# Altium schematic sheet Auxiliary Motors.SchDoc
size A4; Organization: Altium Limited; Address1: L3, 12a Rodborough Rd; Address2: Frenchs Forest; Address3: NSW; Address4: Australia 2086
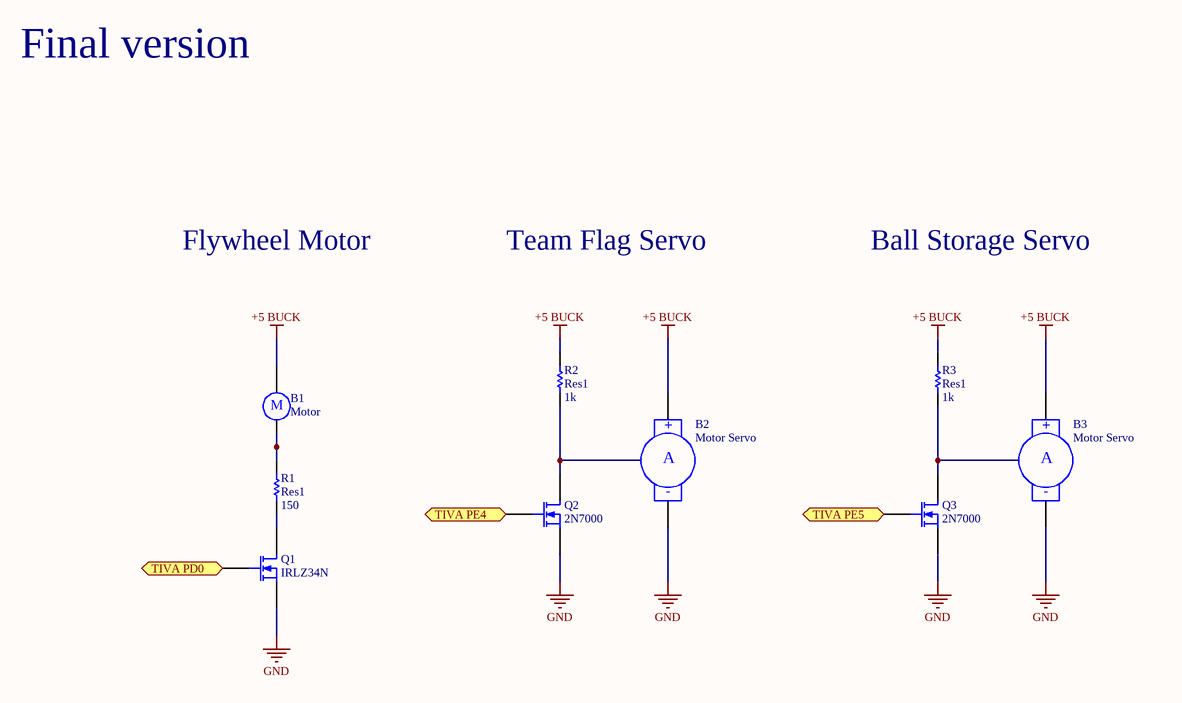
[diagram p0: Auxiliary Motors.SchDoc]

## Parts
B1  Motor  [RB5-10.5]
B2  Motor Servo  [RAD-0.4]
B3  Motor Servo  [RAD-0.4]
Q1  IRLZ34N  [BCY-W3/H.8]
Q2  2N7000  [BCY-W3/H.8]
Q3  2N7000  [BCY-W3/H.8]
R1  Res1  value 150  [AXIAL-0.3]
R2  Res1  value 1k  [AXIAL-0.3]
R3  Res1  value 1k  [AXIAL-0.3]

## Ports
TIVA PD0, TIVA PE4, TIVA PE5

## Nets
+5 BUCK: B1.1 B2.1(+) B3.1(+) R2.2 R3.2
GND: B2.2(-) B3.2(-) Q1.3(S) Q2.3(S) Q3.3(S)
TIVA PD0: Q1.2(G) ; port TIVA PD0
TIVA PE4: Q2.2(G) ; port TIVA PE4
TIVA PE5: Q3.2(G) ; port TIVA PE5
NetB1_2: B1.2 R1.2
NetQ1_1: Q1.1(D) R1.1
NetQ2_1: Q2.1(D) R2.1
NetQ3_1: Q3.1(D) R3.1

## Notes on the sheet
- Final version
- Flywheel Motor
- Team Flag Servo
- Ball Storage Servo
- Title
- Size:
- Date:
- A4
- Number:
- Time:
- Revision:
- Sheet
- of
- File:
- (in symbol Motor) M
- (in symbol Motor Servo) A

## Library data of the parts
B1 = Motor: Motor, General Kind; Manufacturer: Generic Components; Published: 1999
B2 B3 = Motor Servo: Servo Motor; Manufacturer: Generic Components; Published: 1999
Q1-Q3 = MOSFET-N: N-Channel MOSFET; Manufacturer: Generic Components; Class: Discrete; SubClass: MOSFET - Low Power; Published: 08/06/2000; Publisher: Altium Hobart Technology Centre
R1-R3 = Res1: Resistor; Manufacturer: Generic Components; Class: Passive; Published: 08/06/2000; Publisher: Altium Hobart Technology Centre; SubClass: Resistor